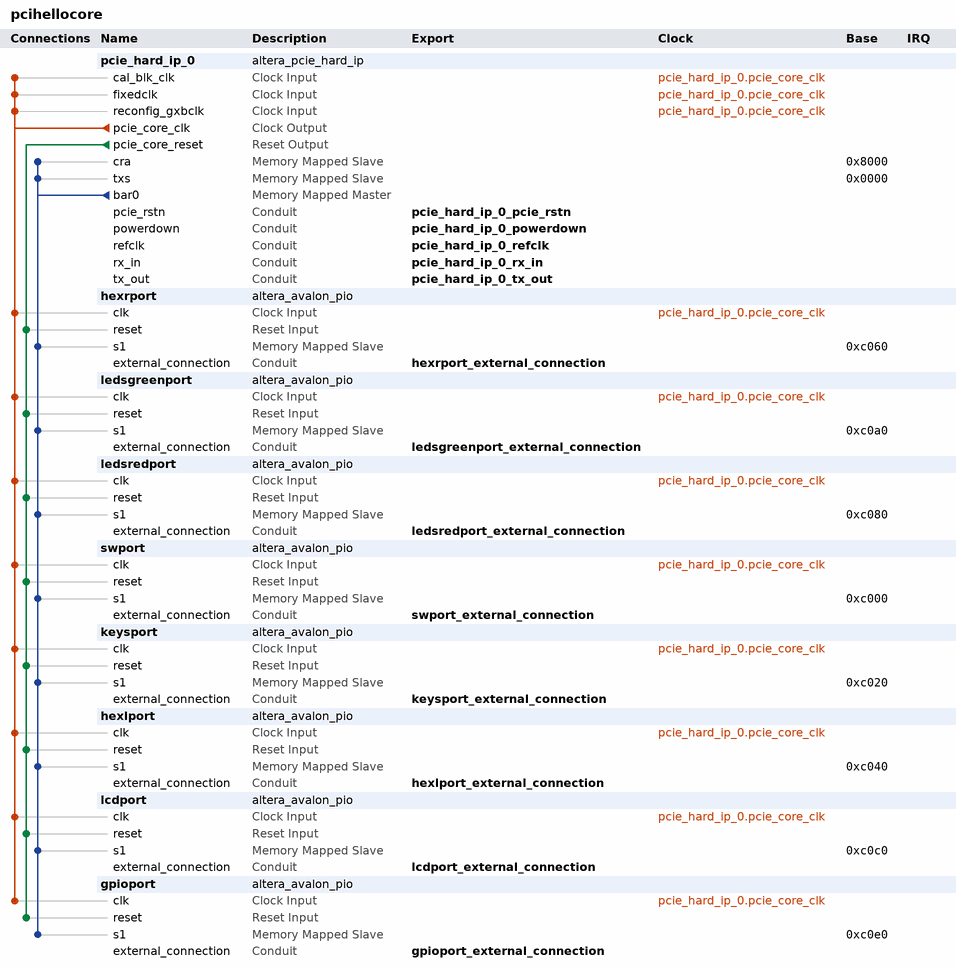
[diagram p0: system contents]
# Platform Designer (Qsys) system pcihellocore, Cyclone IV GX EP4CGX150DF31C7
# Parameters at their usual value, and those the tool derives, are not listed.
package require -exact qsys 17.1
create_system pcihellocore
set_project_property DEVICE_FAMILY {Cyclone IV GX}
set_project_property DEVICE EP4CGX150DF31C7

add_instance pcie_hard_ip_0 altera_pcie_hard_ip 17.1
set_instance_parameter_value pcie_hard_ip_0 {BAR Type} {32 bit Non-Prefetchable,Not used,Not used,Not used,Not used,Not used}
set_instance_parameter_value pcie_hard_ip_0 CB_A2P_ADDR_MAP_PASS_THRU_BITS 15
set_instance_parameter_value pcie_hard_ip_0 CG_ENABLE_A2P_INTERRUPT 0
set_instance_parameter_value pcie_hard_ip_0 CG_NO_CPL_REORDERING 0
set_instance_parameter_value pcie_hard_ip_0 {PCIe Address 31:0} 0x00000000,0x00000000,0x00000000,0x00000000,0x00000000,0x00000000,0x00000000,0x00000000,0x00000000,0x00000000,0x00000000,0x00000000,0x00000000,0x00000000,0x00000000,0x00000000
set_instance_parameter_value pcie_hard_ip_0 {PCIe Address 63:32} 0x00000000,0x00000000,0x00000000,0x00000000,0x00000000,0x00000000,0x00000000,0x00000000,0x00000000,0x00000000,0x00000000,0x00000000,0x00000000,0x00000000,0x00000000,0x00000000
set_instance_parameter_value pcie_hard_ip_0 class_code 0
set_instance_parameter_value pcie_hard_ip_0 device_id 4
set_instance_parameter_value pcie_hard_ip_0 my_advanced_errors false
set_instance_parameter_value pcie_hard_ip_0 my_enable_ecrc_check false
set_instance_parameter_value pcie_hard_ip_0 my_enable_ecrc_gen false
set_instance_parameter_value pcie_hard_ip_0 p_pcie_app_clk 1
set_instance_parameter_value pcie_hard_ip_0 p_pcie_test_out_width None
set_instance_parameter_value pcie_hard_ip_0 p_user_msi_enable 0
set_instance_parameter_value pcie_hard_ip_0 subsystem_device_id 4
set_instance_parameter_value pcie_hard_ip_0 subsystem_vendor_id 4466
set_instance_parameter_value pcie_hard_ip_0 vendor_id 4466

add_instance hexrport altera_avalon_pio 17.1
set_instance_parameter_value hexrport direction Output
set_instance_parameter_value hexrport resetValue 1077952576
set_instance_parameter_value hexrport width 32

add_instance ledsgreenport altera_avalon_pio 17.1
set_instance_parameter_value ledsgreenport direction Output
set_instance_parameter_value ledsgreenport width 32

add_instance ledsredport altera_avalon_pio 17.1
set_instance_parameter_value ledsredport direction Output
set_instance_parameter_value ledsredport width 32

add_instance swport altera_avalon_pio 17.1
set_instance_parameter_value swport direction Input
set_instance_parameter_value swport width 32

add_instance keysport altera_avalon_pio 17.1
set_instance_parameter_value keysport direction Input
set_instance_parameter_value keysport width 32

add_instance hexlport altera_avalon_pio 17.1
set_instance_parameter_value hexlport direction Output
set_instance_parameter_value hexlport resetValue 1077952576
set_instance_parameter_value hexlport width 32

add_instance lcdport altera_avalon_pio 17.1
set_instance_parameter_value lcdport direction Output
set_instance_parameter_value lcdport width 32

add_instance gpioport altera_avalon_pio 17.1
set_instance_parameter_value gpioport direction Output
set_instance_parameter_value gpioport width 32

# connections
add_connection pcie_hard_ip_0.pcie_core_clk gpioport.clk clock
add_connection pcie_hard_ip_0.pcie_core_clk hexlport.clk clock
add_connection pcie_hard_ip_0.pcie_core_clk hexrport.clk clock
add_connection pcie_hard_ip_0.pcie_core_clk keysport.clk clock
add_connection pcie_hard_ip_0.pcie_core_clk lcdport.clk clock
add_connection pcie_hard_ip_0.pcie_core_clk ledsgreenport.clk clock
add_connection pcie_hard_ip_0.pcie_core_clk ledsredport.clk clock
add_connection pcie_hard_ip_0.pcie_core_clk pcie_hard_ip_0.cal_blk_clk clock
add_connection pcie_hard_ip_0.pcie_core_clk pcie_hard_ip_0.fixedclk clock
add_connection pcie_hard_ip_0.pcie_core_clk pcie_hard_ip_0.reconfig_gxbclk clock
add_connection pcie_hard_ip_0.pcie_core_clk swport.clk clock
add_connection pcie_hard_ip_0.pcie_core_reset gpioport.reset reset
add_connection pcie_hard_ip_0.pcie_core_reset hexlport.reset reset
add_connection pcie_hard_ip_0.pcie_core_reset hexrport.reset reset
add_connection pcie_hard_ip_0.pcie_core_reset keysport.reset reset
add_connection pcie_hard_ip_0.pcie_core_reset lcdport.reset reset
add_connection pcie_hard_ip_0.pcie_core_reset ledsgreenport.reset reset
add_connection pcie_hard_ip_0.pcie_core_reset ledsredport.reset reset
add_connection pcie_hard_ip_0.pcie_core_reset swport.reset reset
add_connection pcie_hard_ip_0.bar0 gpioport.s1 avalon
set_connection_parameter_value pcie_hard_ip_0.bar0/gpioport.s1 baseAddress 0xc0e0
add_connection pcie_hard_ip_0.bar0 hexlport.s1 avalon
set_connection_parameter_value pcie_hard_ip_0.bar0/hexlport.s1 baseAddress 0xc040
add_connection pcie_hard_ip_0.bar0 hexrport.s1 avalon
set_connection_parameter_value pcie_hard_ip_0.bar0/hexrport.s1 baseAddress 0xc060
add_connection pcie_hard_ip_0.bar0 keysport.s1 avalon
set_connection_parameter_value pcie_hard_ip_0.bar0/keysport.s1 baseAddress 0xc020
add_connection pcie_hard_ip_0.bar0 lcdport.s1 avalon
set_connection_parameter_value pcie_hard_ip_0.bar0/lcdport.s1 baseAddress 0xc0c0
add_connection pcie_hard_ip_0.bar0 ledsgreenport.s1 avalon
set_connection_parameter_value pcie_hard_ip_0.bar0/ledsgreenport.s1 baseAddress 0xc0a0
add_connection pcie_hard_ip_0.bar0 ledsredport.s1 avalon
set_connection_parameter_value pcie_hard_ip_0.bar0/ledsredport.s1 baseAddress 0xc080
add_connection pcie_hard_ip_0.bar0 pcie_hard_ip_0.cra avalon
set_connection_parameter_value pcie_hard_ip_0.bar0/pcie_hard_ip_0.cra baseAddress 0x8000
add_connection pcie_hard_ip_0.bar0 pcie_hard_ip_0.txs avalon
set_connection_parameter_value pcie_hard_ip_0.bar0/pcie_hard_ip_0.txs baseAddress 0x0000
add_connection pcie_hard_ip_0.bar0 swport.s1 avalon
set_connection_parameter_value pcie_hard_ip_0.bar0/swport.s1 baseAddress 0xc000

# exported interfaces
add_interface gpioport_external_connection conduit end
set_interface_property gpioport_external_connection EXPORT_OF gpioport.external_connection
add_interface hexlport_external_connection conduit end
set_interface_property hexlport_external_connection EXPORT_OF hexlport.external_connection
add_interface hexrport_external_connection conduit end
set_interface_property hexrport_external_connection EXPORT_OF hexrport.external_connection
add_interface keysport_external_connection conduit end
set_interface_property keysport_external_connection EXPORT_OF keysport.external_connection
add_interface lcdport_external_connection conduit end
set_interface_property lcdport_external_connection EXPORT_OF lcdport.external_connection
add_interface ledsgreenport_external_connection conduit end
set_interface_property ledsgreenport_external_connection EXPORT_OF ledsgreenport.external_connection
add_interface ledsredport_external_connection conduit end
set_interface_property ledsredport_external_connection EXPORT_OF ledsredport.external_connection
add_interface pcie_hard_ip_0_pcie_rstn conduit end
set_interface_property pcie_hard_ip_0_pcie_rstn EXPORT_OF pcie_hard_ip_0.pcie_rstn
add_interface pcie_hard_ip_0_powerdown conduit end
set_interface_property pcie_hard_ip_0_powerdown EXPORT_OF pcie_hard_ip_0.powerdown
add_interface pcie_hard_ip_0_refclk conduit end
set_interface_property pcie_hard_ip_0_refclk EXPORT_OF pcie_hard_ip_0.refclk
add_interface pcie_hard_ip_0_rx_in conduit end
set_interface_property pcie_hard_ip_0_rx_in EXPORT_OF pcie_hard_ip_0.rx_in
add_interface pcie_hard_ip_0_tx_out conduit end
set_interface_property pcie_hard_ip_0_tx_out EXPORT_OF pcie_hard_ip_0.tx_out
add_interface swport_external_connection conduit end
set_interface_property swport_external_connection EXPORT_OF swport.external_connection

set_interconnect_requirement {$system} qsys_mm.clockCrossingAdapter HANDSHAKE
set_interconnect_requirement {$system} qsys_mm.maxAdditionalLatency 1

save_system pcihellocore.qsys
